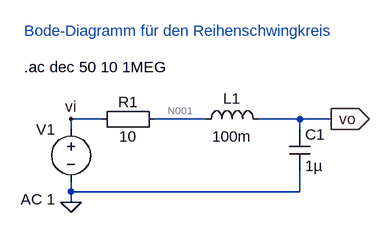
[diagram p0: schematic kap137_reisch.asc]
kap137_reisch.asc, the LTspice schematic file:
Version 4
SHEET 1 880 680
WIRE 80 112 32 112
WIRE 240 112 160 112
WIRE 384 112 320 112
WIRE 432 112 384 112
WIRE 32 128 32 112
WIRE 384 128 384 112
WIRE 32 224 32 208
WIRE 384 224 384 192
WIRE 384 224 32 224
WIRE 32 240 32 224
FLAG 32 240 0
FLAG 432 112 vo
IOPIN 432 112 Out
FLAG 32 112 vi
SYMBOL cap 368 128 R0
SYMATTR InstName C1
SYMATTR Value 1µ
SYMBOL Misc\\EuropeanResistor 176 96 R90
WINDOW 0 5 56 VBottom 2
WINDOW 3 27 56 VTop 2
SYMATTR InstName R1
SYMATTR Value 10
SYMBOL voltage 32 112 M0
WINDOW 123 24 124 Left 2
WINDOW 39 0 0 Left 0
SYMATTR Value2 AC 1
SYMATTR InstName V1
SYMATTR Value ""
SYMBOL ind 224 128 R270
WINDOW 0 32 56 VTop 2
WINDOW 3 5 56 VBottom 2
SYMATTR InstName L1
SYMATTR Value 100m
TEXT -40 -24 Left 2 ;Bode-Diagramm für den Reihenschwingkreis
TEXT -40 32 Left 2 !.ac dec 50 10 1MEG

The netlist it stands for:
* kap137_reisch.asc
C1 vo 0 1µ
R1 N001 vi 10
V1 vi 0 AC 1
L1 N001 vo 100m
* Bode-Diagramm für den Reihenschwingkreis
.ac dec 50 10 1MEG
.backanno
.end

* Results of the author's LTspice run, read from the files saved beside the schematic
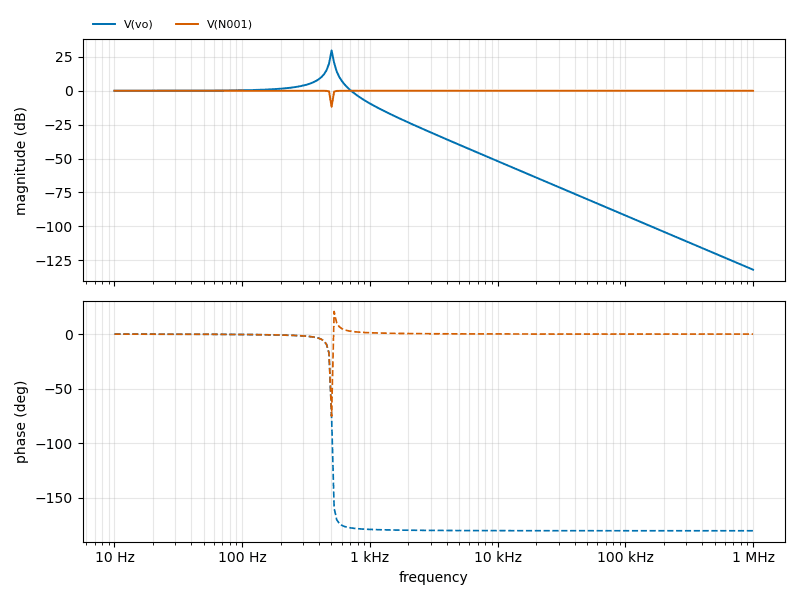
[diagram p1: AC Analysis of kap137_reisch.asc, plotted from the saved traces]
* AC Analysis, 1 run:
*   V(vo): 0.00 dB at 10 Hz, -131.93 dB at 1 MHz, peak 29.74 dB at 501.2 Hz, 3 dB below the peak at 494.1 Hz and 508.8 Hz
*   V(N001): -0.00 dB at 10 Hz, -0.00 dB at 1 MHz, peak -0.00 dB at 1 MHz, 3 dB below the peak at 519.6 Hz